# EAGLE design TouScruino-IL-v0 (EAGLE 6.3)
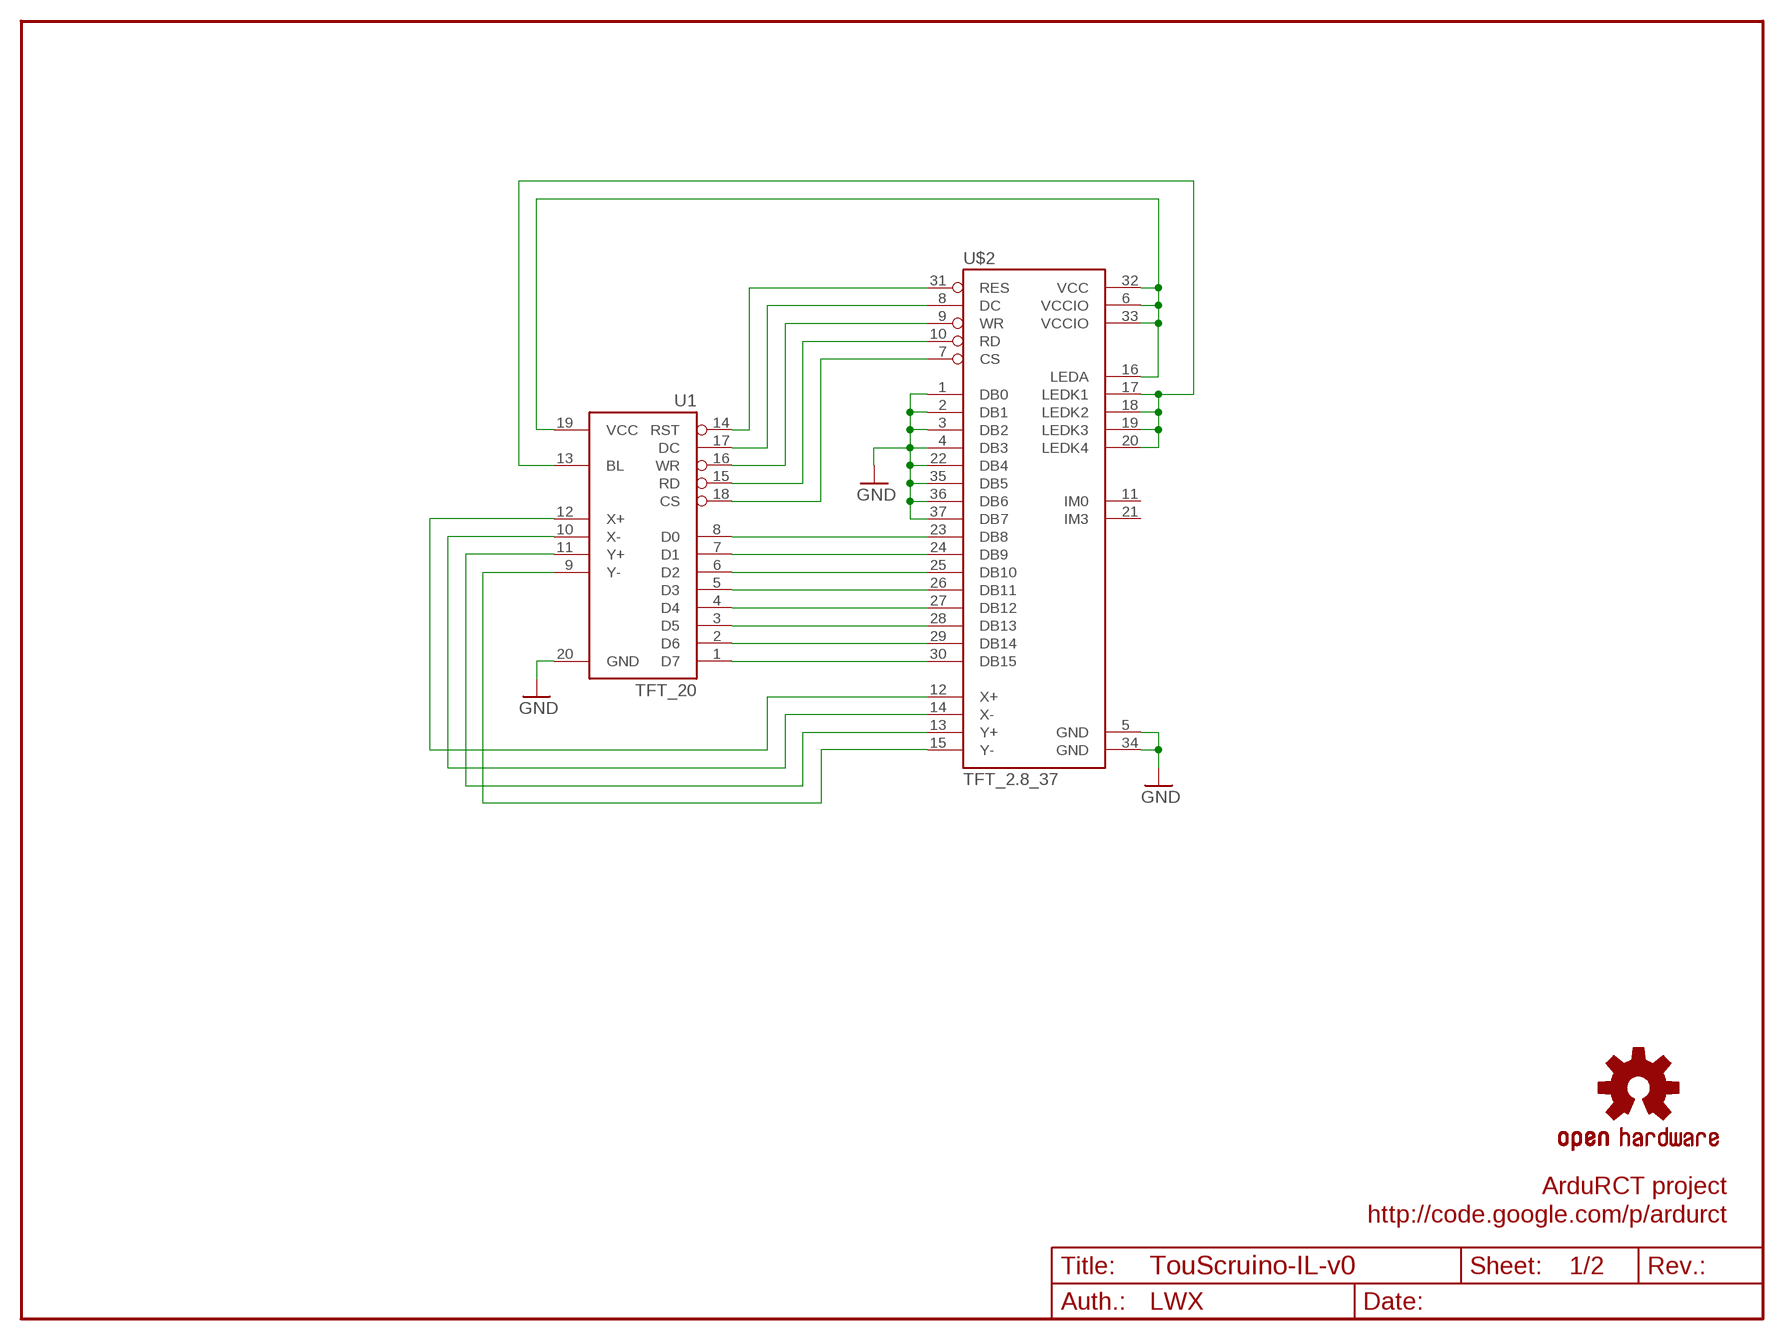
[diagram p0: schematic, sheet 1]

## Parts
U1  TFT_20  [1X20]
U$2  TFT_2.8_37  [TFT_2.8_37]
U$3  OSHW-LOGOM  [OSHW-LOGO-M]

## Nets
GND: U1.20(GND) U$2.1(DB0) U$2.2(DB1) U$2.3(DB2) U$2.4(DB3) U$2.5(GND) U$2.22(DB4) U$2.34(GND) U$2.35(DB5) U$2.36(DB6) U$2.37(DB7)
N$1: U1.19(VCC) U$2.6(VCCIO) U$2.16(LEDA) U$2.32(VCC) U$2.33(VCCIO)
N$2: U1.13(BL) U$2.17(LEDK1) U$2.18(LEDK2) U$2.19(LEDK3) U$2.20(LEDK4)
N$3: U1.8(D0) U$2.23(DB8)
N$4: U1.7(D1) U$2.24(DB9)
N$5: U1.9(Y-) U$2.15(Y-)
N$6: U1.11(Y+) U$2.13(Y+)
N$7: U1.10(X-) U$2.14(X-)
N$8: U1.12(X+) U$2.12(X+)
N$9: U1.14(RST) U$2.31(RES)
N$10: U1.17(DC) U$2.8(DC)
N$11: U1.16(WR) U$2.9(WR)
N$12: U1.15(RD) U$2.10(RD)
N$13: U1.18(CS) U$2.7(CS)
N$14: U1.6(D2) U$2.25(DB10)
N$15: U1.5(D3) U$2.26(DB11)
N$16: U1.4(D4) U$2.27(DB12)
N$17: U1.3(D5) U$2.28(DB13)
N$18: U1.2(D6) U$2.29(DB14)
N$19: U1.1(D7) U$2.30(DB15)
Unconnected: U$2.11(IM0) U$2.21(IM3)

## Notes on the sheet
- ArduRCT project
- http://code.google.com/p/ardurct
- 1/2
- LWX

## Library data of the parts
U1 = wibauxl:TFT_20
U$2 = wibauxl:TFT_2.8_37
U$3 = SparkFun:OSHW-LOGO: Open Source Hardware Logo This logo indicates the piece of hardware it is found on incorporates a OSHW license and/or adheres to the definition of open source hardware found here: http://freedomdefined.org/OSHW

## Net classes
0 default: width 0.203 mm
1 vcc: width 0.254 mm

## Board
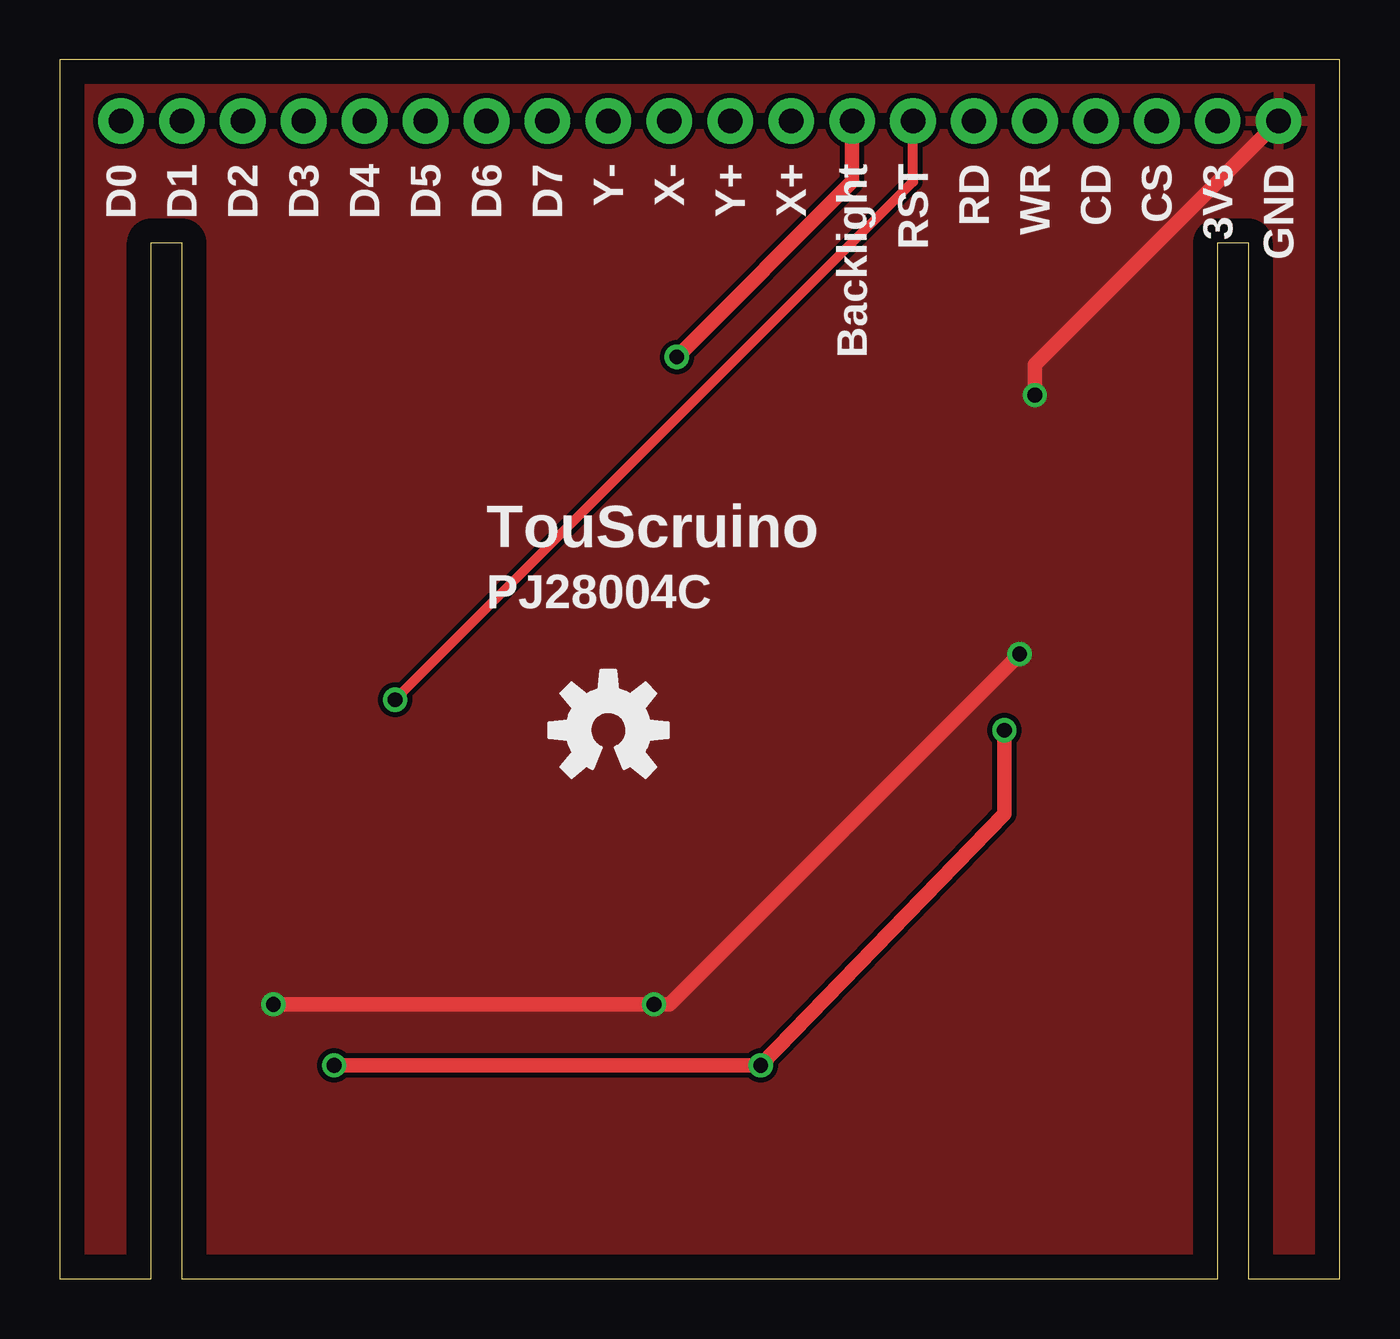
[diagram p1: board, top side]
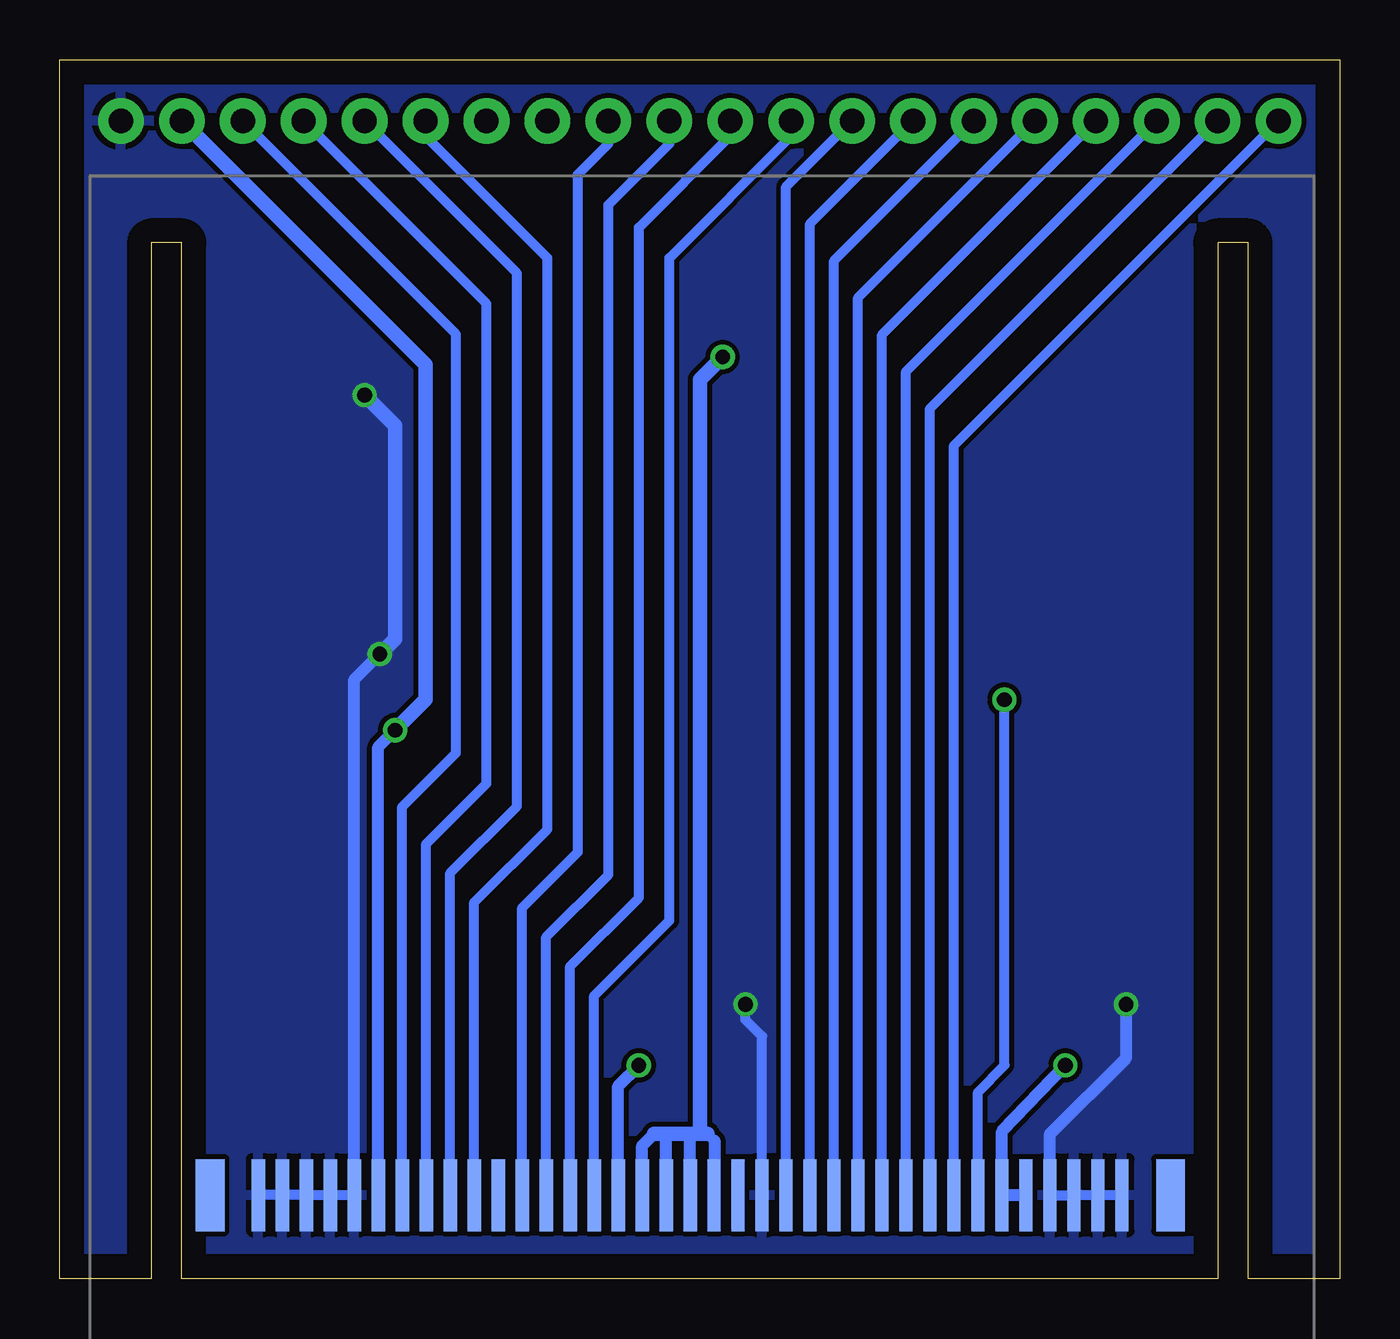
[diagram p2: board, bottom side, seen from below]

Size 53.34 x 50.8 mm. Coordinates in mm from the lower left corner, seen from the top.
Outline: 53.34,0 53.34,50.8 0,50.8 0,0 3.81,0 3.81,43.18 5.08,43.18 5.08,0 48.26,0 48.26,43.18 49.53,43.18 49.53,0 53.34,0
Copper layers (1*16): Top 0.035mm / dielectric 1.5mm / Bottom 0.035mm
Design rules "default": minimum track width 10mil, minimum drill 24mil, track to track 8mil, track to pad 8mil, pad to pad 8mil, via to via 8mil, smd to smd 8mil, copper to edge 40mil, drill to drill 8mil, minimum pad ring 10mil, minimum via ring 8mil, stop-mask expansion 4mil, vias tented up to drill 0mil, thermal gap 10mil

### Footprints (pad centres in the part's own frame; a part is rotated, then mirrored left to right if it is on the bottom)
1X20 = drill 1.016 pad 1.905: 1 0,0; 2 2.54,0; 3 5.08,0; 4 7.62,0; 5 10.16,0; 6 12.7,0; 7 15.24,0; 8 17.78,0; 9 20.32,0; 10 22.86,0; 11 25.4,0; 12 27.94,0; 13 30.48,0; 14 33.02,0; 15 35.56,0; 16 38.1,0; 17 40.64,0; 18 43.18,0; 19 45.72,0; 20 48.26,0
TFT_2.8_37 = smd 0.55 x 3: 1 7,26.5; 2 8,26.5; 3 9,26.5; 4 10,26.5; 5 11,26.5; 6 12,26.5; 7 13,26.5; 8 14,26.5; 9 15,26.5; 10 16,26.5; 11 17,26.5; 12 18,26.5; 13 19,26.5; 14 20,26.5; 15 21,26.5; 16 22,26.5; 17 23,26.5; 18 24,26.5; 19 25,26.5; 20 26,26.5; 21 27,26.5; 22 28,26.5; 23 29,26.5; 24 30,26.5; 25 31,26.5; 26 32,26.5; 27 33,26.5; 28 34,26.5; 29 35,26.5; 30 36,26.5; 31 37,26.5; 32 38,26.5; 33 39,26.5; 34 40,26.5; 35 41,26.5; 36 42,26.5; 37 43,26.5 | smd 1.2 x 3: 75 4.988,26.5; 76 45.028,26.5

### Placement (x,y rotation side)
U1  2.54,48.26 0 top
U$2  52.07,-23.02 0 bottom
U$3  22.86,22.86 0 top

### Tracks (layer width: path | path; a pad name or v marks a point on that pad's centre or on a via)
GND  (via drill 0.61)
  Top 0.61: v40.64,36.83 40.64,38.1 U1.20 | v8.89,11.43 v24.77,11.43 25.4,11.43 v40.01,26.04
  Bottom 0.406: U$2.5 U$2.4 U$2.3 43.18,3.48 43.18,3.49 44.07,3.49 U$2.2 44.13,3.48 44.13,3.49 45.07,3.49 U$2.1 | U$2.34 U$2.35 | U$2.35 11.11,3.48 11.11,3.49 10.79,3.49 | 10.07,3.49 9.07,3.49 U$2.37 | U$2.35 10.79,3.48 10.79,3.49 | 10.79,3.49 10.07,3.49 | 10.07,3.49 U$2.36 | 12.07,6.04 12.06,6.04 12.06,6.03 | U$2.22 24.07,10.1 24.77,10.79 v24.77,11.43
  Bottom 0.508: v40.01,26.04 41.07,24.97 U$2.5 | 12.06,6.03 8.89,9.21 v8.89,11.43 | U$2.34 12.07,6.04
  Bottom 0.61: v40.64,36.83 39.37,35.56 39.37,26.67 v40.01,26.04
  pour Bottom: 0,72.07 53.34,72.07 53.34,0 0,0
  pour Top: 0,69.22 53.34,69.22 53.34,0 0,0
N$1  (via drill 0.61)
  Top 0.61: v11.43,8.89 v29.21,8.89 39.37,19.37 v39.37,22.86
  Bottom 0.508: v39.37,22.86 40.07,22.16 U$2.6 | v29.21,8.89 30.07,8.03 U$2.16 | v11.43,8.89 14.07,6.13 U$2.32 U$2.33
  Bottom 0.61: U1.19 38.1,38.1 38.1,24.13 v39.37,22.86
N$2  (via drill 0.61)
  Top 0.61: v25.72,38.42 33.02,45.72 U1.13
  Bottom 0.406: 28.07,5.9 27.94,6.03 | 27.15,6.03 27.07,5.95 26.99,6.03 | 26.07,5.75 26.35,6.03
  Bottom 0.508: U$2.17 29.07,5.54 28.57,6.03 | U$2.18 28.07,5.9 | U$2.19 27.07,5.95 | U$2.20 26.05,3.48 26.04,3.49 26.04,5.71 26.07,5.75
  Bottom 0.61: 26.67,6.03 26.67,37.47 v25.72,38.42 | 28.57,6.03 27.94,6.03 27.15,6.03 | 26.35,6.03 26.67,6.03 | 26.99,6.03 26.67,6.03
N$3
  Bottom 0.406: U$2.23 23.07,45.51 U1.8
N$4
  Bottom 0.406: U$2.24 22.07,43.97 U1.7
N$5
  Bottom 0.406: U1.9 22.86,47.62 27.94,42.55 27.94,14.92 31.07,11.79 U$2.15
N$6
  Bottom 0.406: U1.11 27.94,47.31 30.48,44.77 30.48,16.83 33.07,14.24 U$2.13
N$7
  Bottom 0.406: U1.10 25.4,47.62 29.21,43.81 29.21,15.88 32.07,13.02 U$2.14
N$8
  Bottom 0.406: U1.12 30.48,47.31 31.75,46.04 31.75,17.78 34.07,15.46 U$2.12
N$9  (via drill 0.61)
  Top 0.406: U1.14 35.56,45.72 v13.97,24.13
  Bottom 0.406: v13.97,24.13 13.97,8.89 15.07,7.77 U$2.31
N$10
  Bottom 0.406: U1.17 35.56,40.64 35.56,20.64 38.07,18.13 U$2.8
N$11
  Bottom 0.406: U1.16 34.29,41.91 34.29,19.68 37.07,16.91 U$2.9
N$12
  Bottom 0.406: U1.15 38.1,47.62 33.02,42.55 33.02,18.73 36.07,15.68 U$2.10
N$13
  Bottom 0.406: U1.18 36.83,39.37 36.83,21.91 39.07,19.67 U$2.7
N$14
  Bottom 0.406: U$2.25 21.07,42.43 U1.6
N$15
  Bottom 0.406: U$2.26 20.07,40.89 U1.5
N$16
  Bottom 0.406: U$2.27 19.07,39.35 U1.4
N$17
  Bottom 0.406: U$2.28 18.07,37.81 U1.3
N$18
  Bottom 0.406: U$2.29 17.07,36.27 U1.2
N$19
  Bottom 0.406: U$2.30 16.07,34.73 U1.1

### Text on the board
tPlace: D0 | D1 | D2 | D3 | D4 | D5 | D6 | D7 | Y- | X- | Y+ | X+ | Backlight | RST | RD | WR | CD | CS | 3V3 | GND | TouScruino | PJ28004C